# EAGLE design Nixie_Newxie_Shield_v1 (EAGLE 9.6.2)
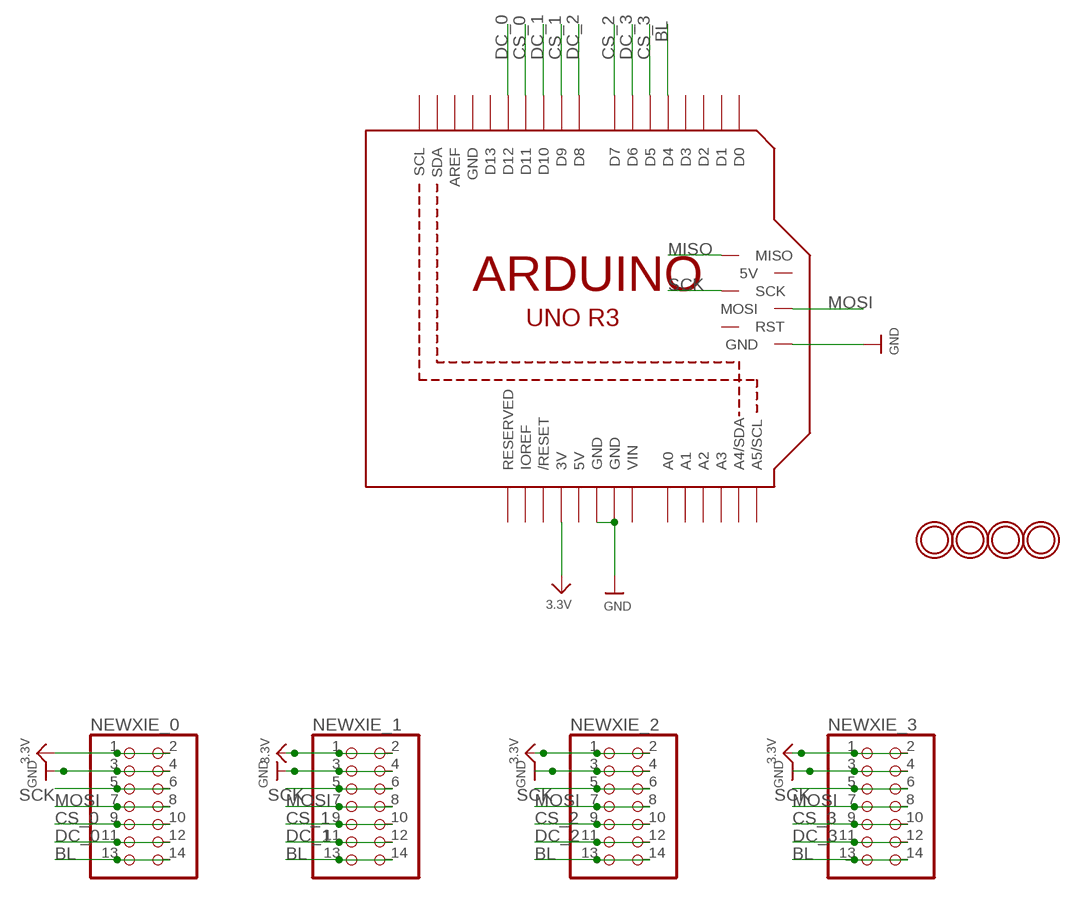
[diagram p0: schematic, sheet 1]

## Parts
NEWXIE_0  HEADER-2X7  [2X07]
NEWXIE_1  HEADER-2X7  [2X07]
NEWXIE_2  HEADER-2X7  [2X07]
NEWXIE_3  HEADER-2X7  [2X07]
U$12  MOUNTINGHOLE3.0_NPH  [MOUNTINGHOLE_3.0_NPH]
U$13  MOUNTINGHOLE3.0_NPH  [MOUNTINGHOLE_3.0_NPH]
U$14  MOUNTINGHOLE3.0_NPH  [MOUNTINGHOLE_3.0_NPH]
U$15  MOUNTINGHOLE3.0_NPH  [MOUNTINGHOLE_3.0_NPH]
U$19  ARDUINO_R3_ICSP_NODIM  [ARDUINOR3_ICSP_NODIM]

## Nets
3.3V: NEWXIE_0.1 NEWXIE_0.2 NEWXIE_1.1 NEWXIE_1.2 NEWXIE_2.1 NEWXIE_2.2 NEWXIE_3.1 NEWXIE_3.2 U$19.3V
BL: NEWXIE_0.13 NEWXIE_0.14 NEWXIE_1.13 NEWXIE_1.14 NEWXIE_2.13 NEWXIE_2.14 NEWXIE_3.13 NEWXIE_3.14 U$19.D4
CS_0: NEWXIE_0.9 NEWXIE_0.10 U$19.D11
CS_1: NEWXIE_1.9 NEWXIE_1.10 U$19.D9
CS_2: NEWXIE_2.9 NEWXIE_2.10 U$19.D7
CS_3: NEWXIE_3.9 NEWXIE_3.10 U$19.D5
DC_0: NEWXIE_0.11 NEWXIE_0.12 U$19.D12
DC_1: NEWXIE_1.11 NEWXIE_1.12 U$19.D10
DC_2: NEWXIE_2.11 NEWXIE_2.12 U$19.D8
DC_3: NEWXIE_3.11 NEWXIE_3.12 U$19.D6
GND: NEWXIE_0.3 NEWXIE_0.4 NEWXIE_1.3 NEWXIE_1.4 NEWXIE_2.3 NEWXIE_2.4 NEWXIE_3.3 NEWXIE_3.4 U$19.GND@1(GND) U$19.GND@2(GND) U$19.GND@3(GND)
MISO: U$19.MISO
MOSI: NEWXIE_0.7 NEWXIE_0.8 NEWXIE_1.7 NEWXIE_1.8 NEWXIE_2.7 NEWXIE_2.8 NEWXIE_3.7 NEWXIE_3.8 U$19.MOSI
SCK: NEWXIE_0.5 NEWXIE_0.6 NEWXIE_1.5 NEWXIE_1.6 NEWXIE_2.5 NEWXIE_2.6 NEWXIE_3.5 NEWXIE_3.6 U$19.SCK
Unconnected: U$19.5V_ICSP(5V) U$19.A0 U$19.A1 U$19.A2 U$19.A3 U$19.A4(A4/SDA) U$19.A5(A5/SCL) U$19.AREF U$19.D0 U$19.D1 U$19.D2 U$19.D3 U$19.D13 U$19.IOREF U$19.RESERVED U$19.RESET(/RESET) U$19.RESET_ICSP(RST) U$19.SCL U$19.SDA

## Power pins joined to a net without a drawn wire
5V: U$19.5V
GND: U$19.GND
VIN: U$19.VIN

## Library data of the parts
NEWXIE_0 NEWXIE_1-NEWXIE_3 = microbuilder:HEADER-2X7: PIN HEADER
U$12-U$15 = adafruit_electromech:MOUNTINGHOLE: Mounting Hole For #2 screws (0.086"/2.18mm width, 0.094"/2.4mm hole) use 2.5mm
U$19 = adafruit_micro:ARDUINO_R3_ICSP

## Board
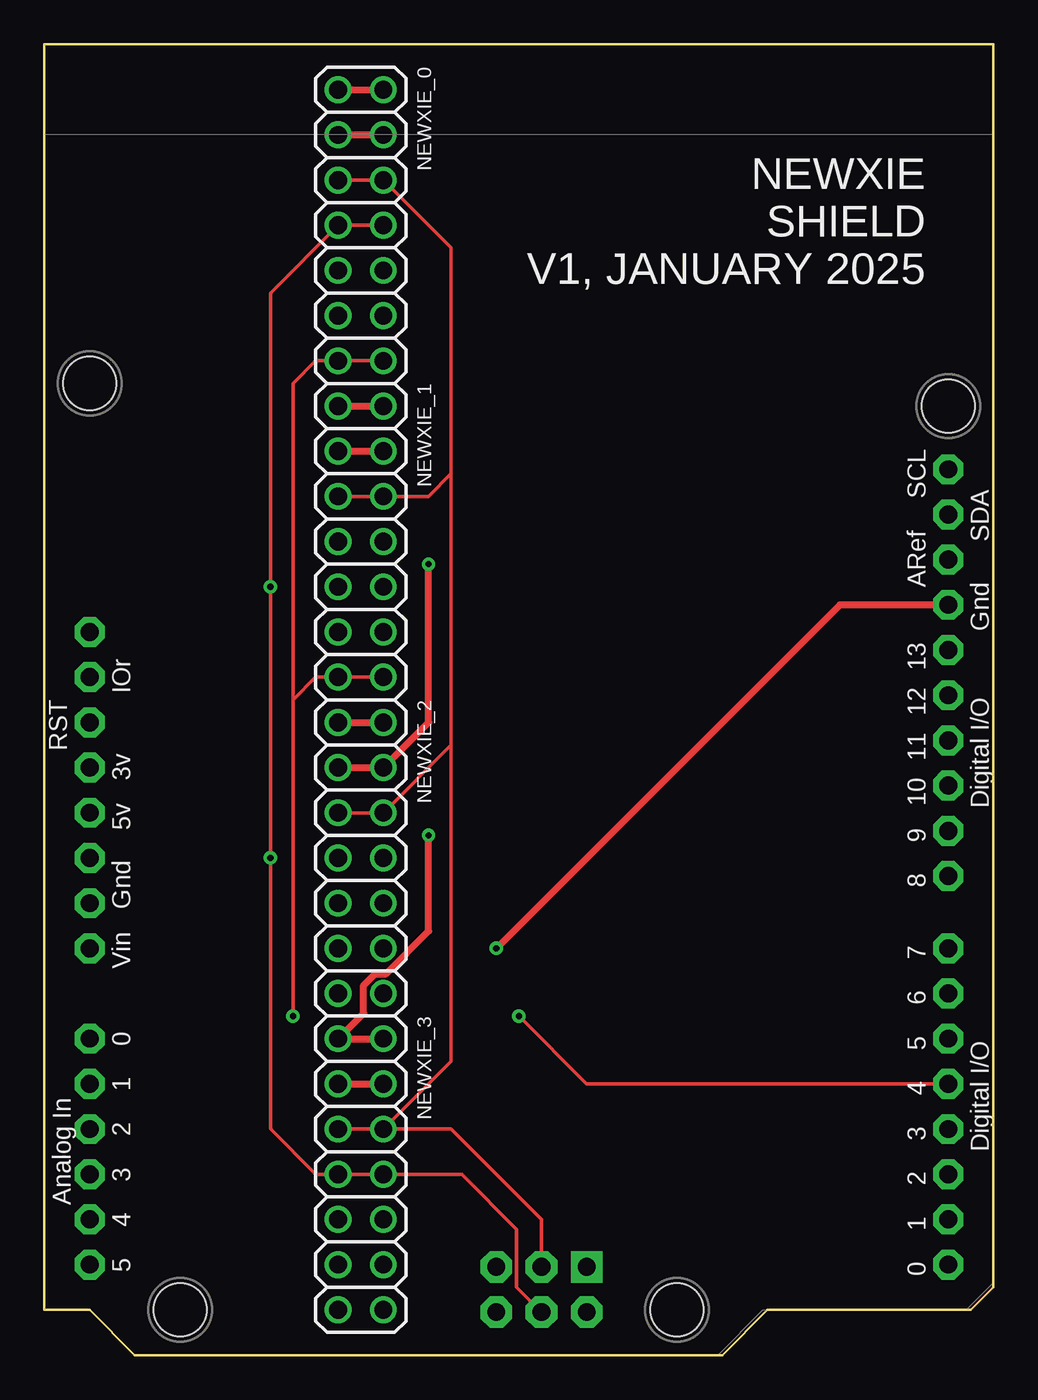
[diagram p1: board, top side]
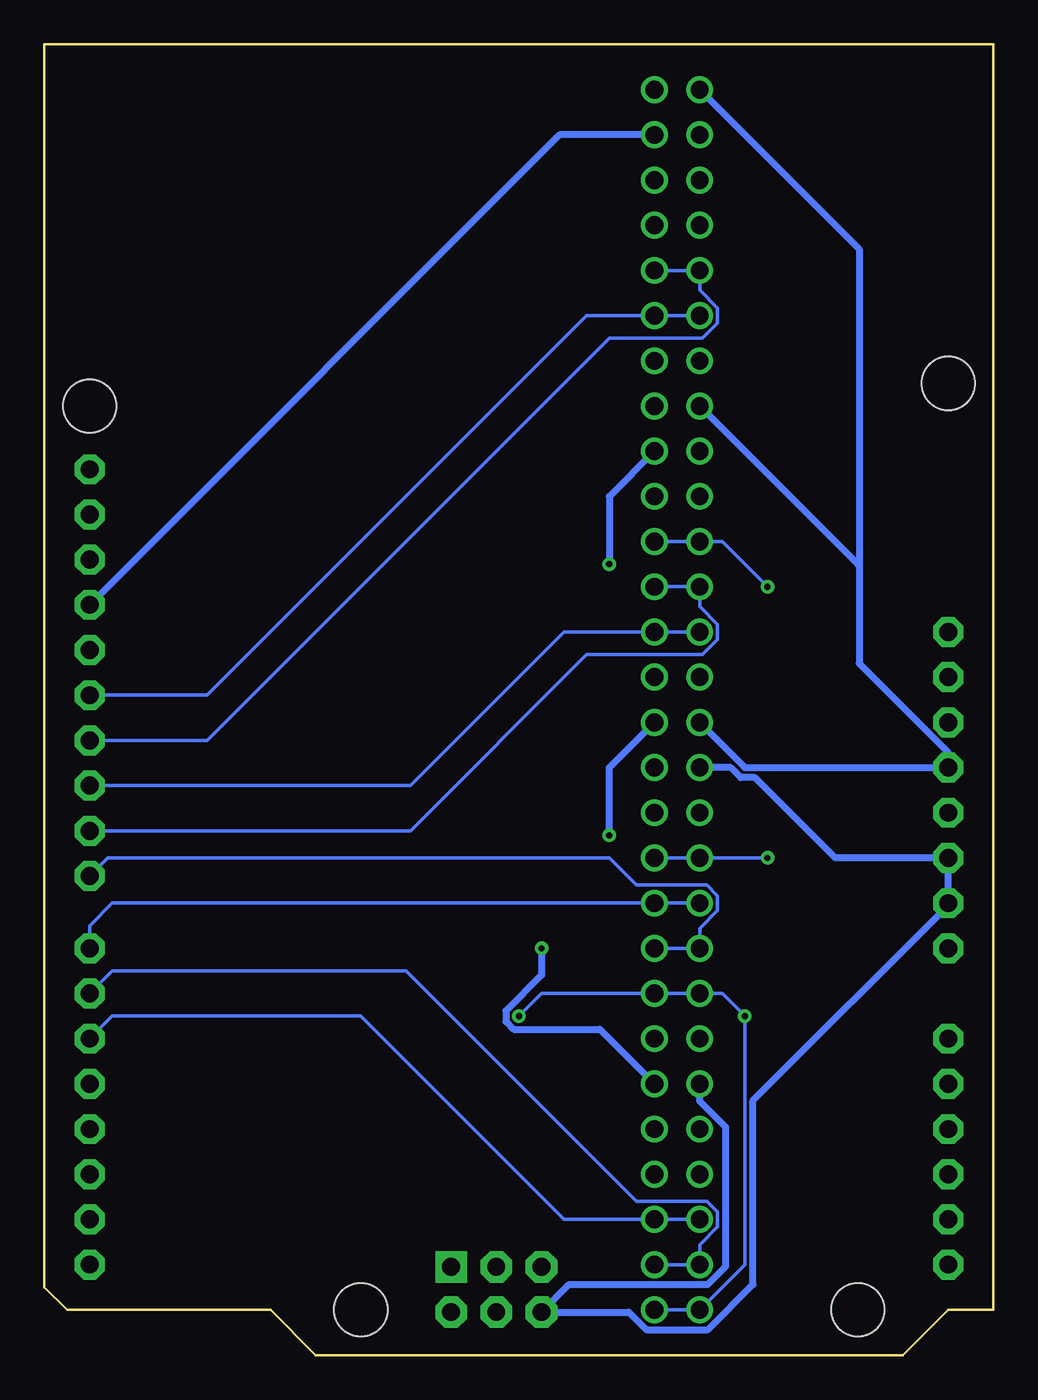
[diagram p2: board, bottom side, seen from below]

Size 53.34 x 73.66 mm. Coordinates in mm from the lower left corner, seen from the top.
Outline: 0,2.54 0,73.66 53.34,73.66 53.34,3.81 52.07,2.54 40.64,2.54 38.1,0 5.08,0 2.54,2.54 0,2.54
Copper layers (1*16): Top 0.035mm / dielectric 1.5mm / Bottom 0.035mm
Design rules "default": minimum track width 6mil, minimum drill 0.35mm, track to track 6mil, track to pad 6mil, pad to pad 6mil, via to via 6mil, smd to smd 6mil, copper to edge 40mil, drill to drill 6mil, minimum pad ring 10mil, minimum via ring 8mil, stop-mask expansion 4mil, vias tented up to drill 0mil, thermal gap 10mil

### Footprints (pad centres in the part's own frame; a part is rotated, then mirrored left to right if it is on the bottom)
2X07 = drill 1: 1 -7.62,-1.27; 2 -7.62,1.27; 3 -5.08,-1.27; 4 -5.08,1.27; 5 -2.54,-1.27; 6 -2.54,1.27; 7 0,-1.27; 8 0,1.27; 9 2.54,-1.27; 10 2.54,1.27; 11 5.08,-1.27; 12 5.08,1.27; 13 7.62,-1.27; 14 7.62,1.27
MOUNTINGHOLE_3.0_NPH = hole 3: 0,0
ARDUINOR3_ICSP_NODIM = drill 1 pad 1.676 octagon: 3V 35.56,2.54; 5V 38.1,2.54; A0 50.8,2.54; A1 53.34,2.54; A2 55.88,2.54; A3 58.42,2.54; A4 60.96,2.54; A5 63.5,2.54; AREF 23.876,50.8; D0 63.5,50.8; D1 60.96,50.8; D2 58.42,50.8; D3 55.88,50.8; D4 53.34,50.8; D5 50.8,50.8; D6 48.26,50.8; D7 45.72,50.8; D8 41.656,50.8; D9 39.116,50.8; D10 36.576,50.8; D11 34.036,50.8; D12 31.496,50.8; D13 28.956,50.8; GND 26.416,50.8; GND@1 43.18,2.54; GND@2 40.64,2.54; IOREF 30.48,2.54; RESERVED 27.94,2.54; RESET 33.02,2.54; SCL 18.796,50.8; SDA 21.336,50.8; VIN 45.72,2.54 | drill 1 pad 1.778 octagon: 5V_ICSP 66.167,30.48; GND@3 66.167,25.4; MOSI 66.167,27.94; RESET_ICSP 63.627,25.4; SCK 63.627,27.94 | drill 1 pad 1.778 square: MISO 63.627,30.48

### Placement (x,y rotation side)
NEWXIE_0  17.78,63.5 270 top
NEWXIE_1  17.78,45.72 270 top
NEWXIE_2  17.78,27.94 270 top
NEWXIE_3  17.78,10.16 270 top
U$12  7.62,2.54 0 top
U$13  35.56,2.54 0 top
U$14  2.54,54.61 0 top
U$15  50.8,53.34 0 top
U$19  0,68.58 270 top

### Tracks (layer width: path | path; a pad name or v marks a point on that pad's centre or on a via)
3.3V  (via drill 0.35)
  Top 0.406: NEWXIE_3.2 NEWXIE_3.1 17.94,19.21 17.94,20.78 18.59,21.43 19.19,21.43 21.59,23.83 v21.59,29.21 | NEWXIE_2.1 NEWXIE_2.2 | NEWXIE_1.1 NEWXIE_1.2 | NEWXIE_0.1 NEWXIE_0.2
  Bottom 0.406: NEWXIE_2.1 13.97,33.02 U$19.3V 2.54,33.87 7.54,38.88 7.54,44.45 | NEWXIE_0.1 7.54,62.15 7.54,44.45 | v21.59,29.21 21.59,33.02 NEWXIE_2.2 | NEWXIE_1.1 7.62,44.45 7.54,44.45
BL  (via drill 0.35)
  Top 0.203: v13.97,19.05 13.97,36.83 | 13.97,36.83 15.24,38.1 NEWXIE_1.13 NEWXIE_1.14 | 13.97,36.83 13.97,54.61 15.24,55.88 NEWXIE_0.13 NEWXIE_0.14 | U$19.D4 30.48,15.24 v26.67,19.05
  Bottom 0.203: NEWXIE_3.14 NEWXIE_3.13 13.97,5.08 v13.97,19.05 15.24,20.32 NEWXIE_2.13 NEWXIE_2.14 25.4,20.32 v26.67,19.05
CS_0
  Bottom 0.203: NEWXIE_0.10 NEWXIE_0.9 16.51,59.85 15.5,58.84 15.5,58 16.35,57.15 21.59,57.15 44.2,34.54 U$19.D11
CS_1
  Bottom 0.203: NEWXIE_1.10 NEWXIE_1.9 16.51,42.07 15.5,41.06 15.5,40.22 16.35,39.37 22.86,39.37 32.77,29.46 U$19.D9
CS_2
  Bottom 0.203: NEWXIE_2.9 NEWXIE_2.10 49.53,25.4 50.8,24.13 U$19.D7
CS_3
  Bottom 0.203: NEWXIE_3.9 NEWXIE_3.10 24.13,7.62 35.56,19.05 49.53,19.05 U$19.D5
DC_0
  Bottom 0.203: NEWXIE_0.11 NEWXIE_0.12 22.86,58.42 44.2,37.08 U$19.D12
DC_1
  Bottom 0.203: NEWXIE_1.11 NEWXIE_1.12 24.13,40.64 32.77,32 U$19.D10
DC_2
  Bottom 0.203: NEWXIE_2.12 NEWXIE_2.11 16.51,23.97 15.5,24.98 15.5,25.82 16.09,26.41 20.06,26.41 21.59,27.94 49.78,27.94 U$19.D8
DC_3
  Bottom 0.203: NEWXIE_3.12 NEWXIE_3.11 16.51,6.19 15.5,7.2 15.5,8.04 16.09,8.63 20.06,8.63 33.02,21.59 49.53,21.59 U$19.D6
GND  (via drill 0.35)
  Top 0.406: NEWXIE_3.3 NEWXIE_3.4 | NEWXIE_2.3 NEWXIE_2.4 21.59,35.56 v21.59,44.45 | NEWXIE_1.3 NEWXIE_1.4 | NEWXIE_0.3 NEWXIE_0.4 | U$19.GND 44.7,42.16 v25.4,22.86
  Bottom 0.406: NEWXIE_2.3 14.76,33.02 14.2,32.46 13.41,32.46 8.89,27.94 U$19.GND@2 U$19.GND@1 2.54,25.27 13.51,14.3 13.51,3.97 16.05,1.43 19.51,1.43 20.49,2.41 U$19.GND@3 23.84,3.97 16.05,3.97 15.04,4.98 15.04,12.8 16.51,14.27 NEWXIE_3.3 | NEWXIE_1.4 21.59,48.26 v21.59,44.45 | v25.4,22.86 25.4,21.36 27.4,19.35 27.4,18.75 26.97,18.32 22.13,18.32 NEWXIE_3.4 | NEWXIE_0.4 24.38,68.58 U$19.GND
MOSI  (via drill 0.35)
  Top 0.203: NEWXIE_0.8 NEWXIE_0.7 12.7,59.69 v12.7,43.18 v12.7,27.94 12.7,12.7 15.24,10.16 NEWXIE_3.7 NEWXIE_3.8 23.46,10.16 26.54,7.08 26.54,3.81 U$19.MOSI
  Bottom 0.203: NEWXIE_1.8 NEWXIE_1.7 15.24,45.72 v12.7,43.18 | NEWXIE_2.8 NEWXIE_2.7 v12.7,27.94
SCK
  Top 0.203: NEWXIE_0.5 NEWXIE_0.6 22.86,62.23 22.86,49.53 | NEWXIE_1.5 NEWXIE_1.6 21.59,48.26 22.86,49.53 | NEWXIE_2.5 NEWXIE_2.6 22.86,34.29 | NEWXIE_3.5 NEWXIE_3.6 | NEWXIE_3.6 21.59,12.7 21.84,12.7 22.86,12.7 27.94,7.62 U$19.SCK | 22.86,49.53 22.86,34.29 | 22.86,34.29 22.86,16.51 NEWXIE_3.6

### Text on the board
tPlace: NEWXIE / SHIELD / V1, JANUARY 2025